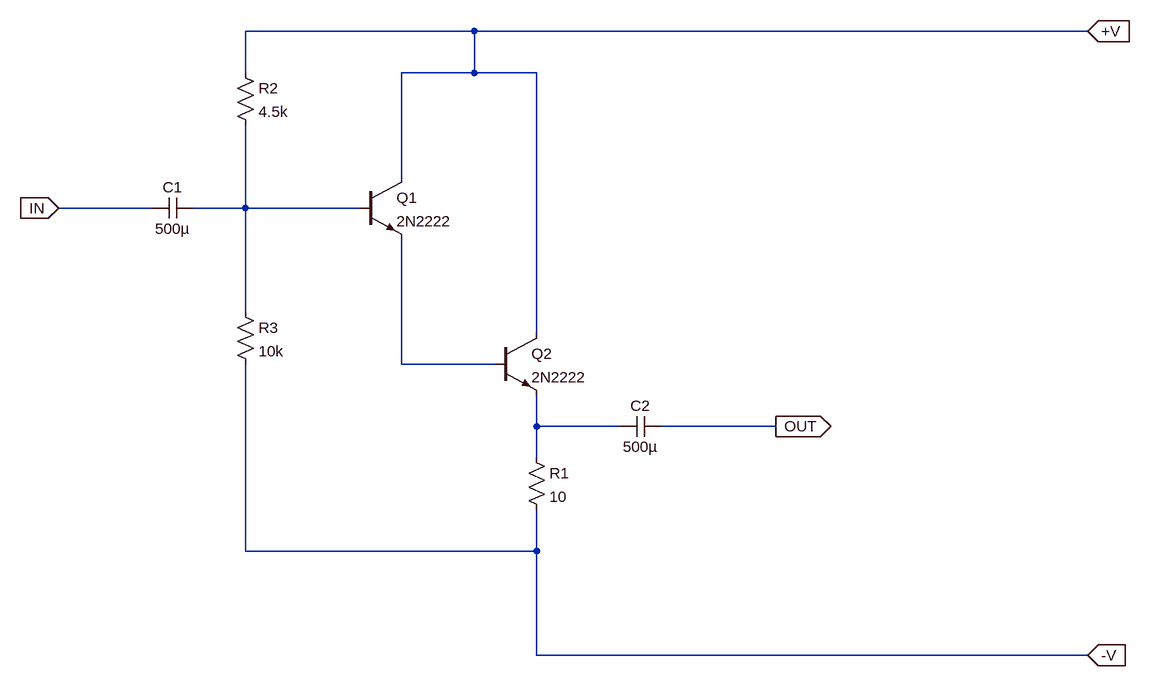
[diagram p0: schematic output_v2_darlington_highin.asc]
output_v2_darlington_highin.asc, the LTspice schematic file:
Version 4
SHEET 1 1588 840
WIRE 384 -192 32 -192
WIRE 1328 -192 384 -192
WIRE 32 -128 32 -192
WIRE 384 -128 384 -192
WIRE 384 -128 272 -128
WIRE 480 -128 384 -128
WIRE 272 32 272 -128
WIRE -112 80 -256 80
WIRE 32 80 32 -48
WIRE 32 80 -48 80
WIRE 208 80 32 80
WIRE 32 240 32 80
WIRE 480 272 480 -128
WIRE 272 320 272 128
WIRE 416 320 272 320
WIRE 480 416 480 368
WIRE 608 416 480 416
WIRE 848 416 672 416
WIRE 480 464 480 416
WIRE 32 608 32 320
WIRE 480 608 480 544
WIRE 480 608 32 608
WIRE 480 768 480 608
WIRE 1328 768 480 768
FLAG 1328 -192 +V
IOPIN 1328 -192 In
FLAG 1328 768 -V
IOPIN 1328 768 In
FLAG 848 416 OUT
IOPIN 848 416 Out
FLAG -256 80 IN
IOPIN -256 80 In
SYMBOL npn 208 32 R0
SYMATTR InstName Q1
SYMATTR Value 2N2222
SYMBOL npn 416 272 R0
SYMATTR InstName Q2
SYMATTR Value 2N2222
SYMBOL res 464 448 R0
SYMATTR InstName R1
SYMATTR Value 10
SYMBOL res 16 -144 R0
SYMATTR InstName R2
SYMATTR Value 4.5k
SYMBOL res 16 224 R0
SYMATTR InstName R3
SYMATTR Value 10k
SYMBOL cap 672 400 R90
WINDOW 0 0 32 VBottom 2
WINDOW 3 32 32 VTop 2
SYMATTR InstName C2
SYMATTR Value 500µ
SYMBOL cap -48 64 R90
WINDOW 0 0 32 VBottom 2
WINDOW 3 32 32 VTop 2
SYMATTR InstName C1
SYMATTR Value 500µ

The netlist it stands for:
* output_v2_darlington_highin.asc
Q1 +V N001 N002 0 2N2222
Q2 +V N002 N003 0 2N2222
R1 N003 -V 10
R2 +V N001 4.5k
R3 N001 -V 10k
C2 OUT N003 500µ
C1 N001 IN 500µ
.model NPN NPN
.model PNP PNP
.lib standard.bjt
.backanno
.end